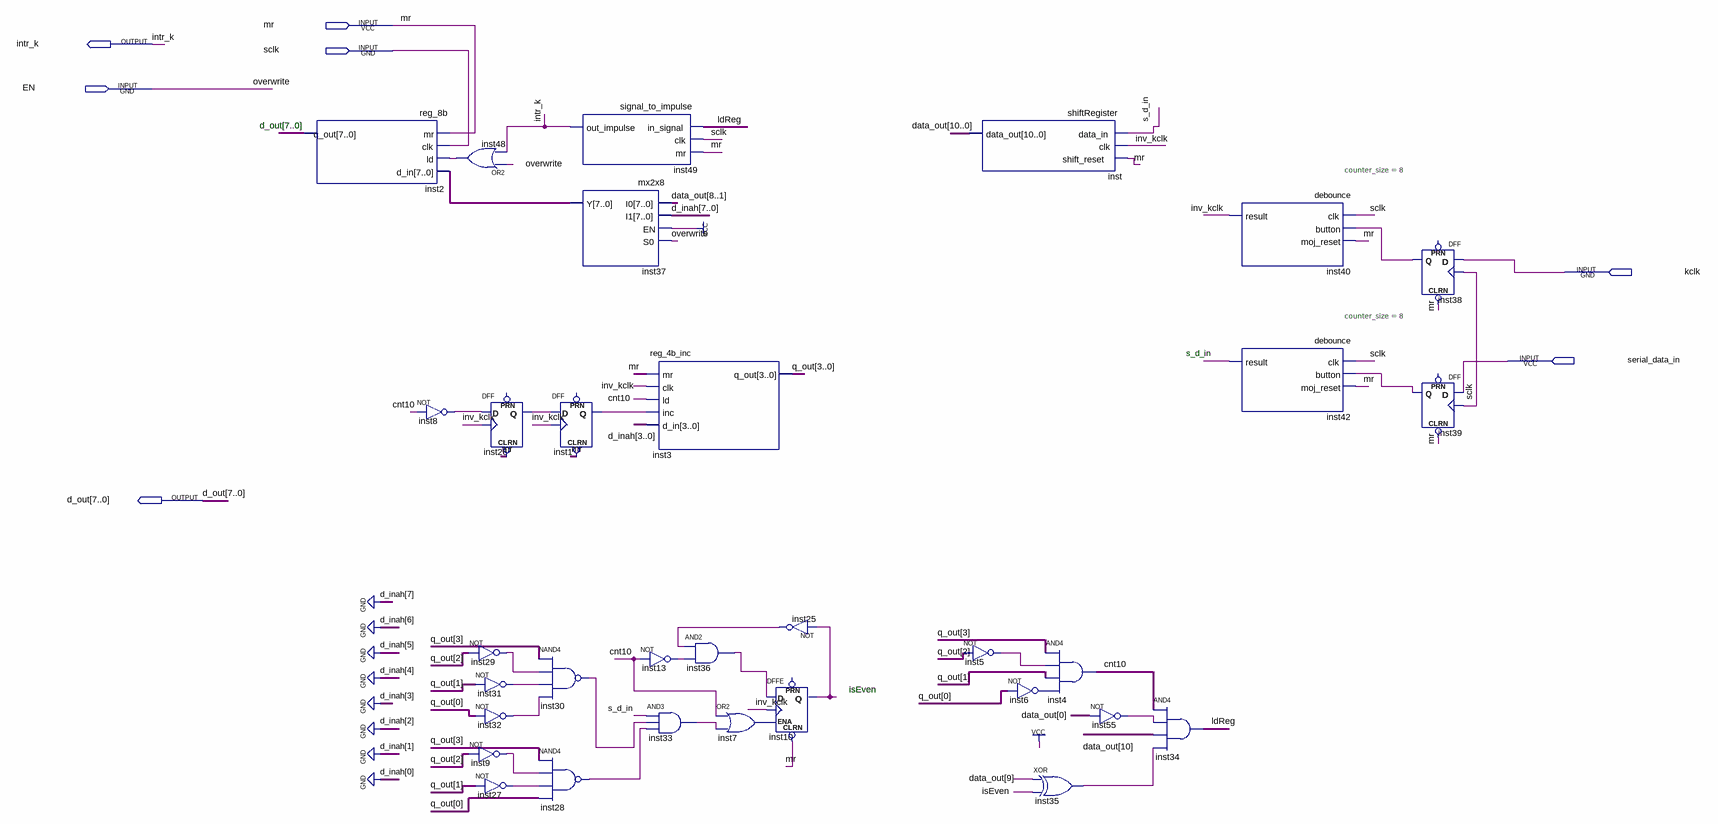
[diagram p0: schematic sheet]
// Quartus schematic ps2controller.bdf as structural Verilog: 32 symbols, 7 pins
module ps2controller (
  input  mr,
  input  sclk,
  input  EN,
  input  kclk,
  input  serial_data_in,
  output intr_k,
  output [7:0] d_out
);

  wire cnt10, inst1_q, inst5_out, inst6_out, inst7_out, inst8_out, inst9_out, inst13_out, inst25_out,
       inst26_q, inst27_out, inst28_out, inst29_out, inst30_out, inst31_out, inst32_out, inst33_out,
       inst35_out, inst36_out, inst38_q, inst39_q, inst48_out, inst55_out, inv_kclk, isEven, ldReg, s_d_in;
  wire [3:0] q_out;
  wire [7:0] inst37_y;
  wire [10:0] data_out;

  reg_8b inst2 (.mr(mr), .clk(sclk), .ld(inst48_out), .d_in(inst37_y), .q_out(d_out));
  not inst8 (inst8_out, cnt10);
  or inst48 (inst48_out, EN, intr_k);
  not inst29 (inst29_out, q_out[2]);
  not inst9 (inst9_out, q_out[2]);
  DFF inst26 (.CLRN(mr), .CLK(inv_kclk), .D(inst8_out), .Q(inst26_q));  // open: PRN
  not inst31 (inst31_out, q_out[1]);
  not inst32 (inst32_out, q_out[0]);
  not inst27 (inst27_out, q_out[1]);
  signal_to_impulse inst49 (.in_signal(ldReg), .clk(sclk), .mr(mr), .out_impulse(intr_k));
  mx2x8 inst37 (.I0(data_out[8:1]), .I1({8{1'b0}}), .EN(1'b1), .S0(EN), .Y(inst37_y));
  DFF inst1 (.CLRN(mr), .CLK(inv_kclk), .D(inst26_q), .Q(inst1_q));  // open: PRN
  nand inst30 (inst30_out, q_out[3], inst29_out, inst31_out, inst32_out);
  nand inst28 (inst28_out, q_out[3], inst9_out, inst27_out, q_out[0]);
  reg_4b_inc inst3 (.mr(mr), .clk(inv_kclk), .ld(cnt10), .inc(inst1_q), .d_in(4'b0000), .q_out(q_out));
  not inst13 (inst13_out, cnt10);
  and inst33 (inst33_out, s_d_in, inst30_out, inst28_out);
  and inst36 (inst36_out, inst25_out, inst13_out);
  or inst7 (inst7_out, cnt10, inst33_out);
  DFFE inst10 (.CLRN(mr), .D(inst36_out), .CLK(inv_kclk), .ENA(inst7_out), .Q(isEven));  // open: PRN
  not inst25 (inst25_out, isEven);
  shiftRegister inst (.data_in(s_d_in), .clk(inv_kclk), .shift_reset(mr), .data_out(data_out));
  not inst5 (inst5_out, q_out[2]);
  not inst6 (inst6_out, q_out[0]);
  and inst4 (cnt10, q_out[3], inst5_out, q_out[1], inst6_out);
  xor inst35 (inst35_out, data_out[9], isEven);
  not inst55 (inst55_out, data_out[0]);
  and inst34 (ldReg, cnt10, inst55_out, data_out[10], inst35_out);
  debounce #(.counter_size(8)) inst40 (.clk(sclk), .button(inst38_q), .moj_reset(mr), .result(inv_kclk));
  debounce #(.counter_size(8)) inst42 (.clk(sclk), .button(inst39_q), .moj_reset(mr), .result(s_d_in));
  DFF inst38 (.CLRN(mr), .CLK(sclk), .D(kclk), .Q(inst38_q));  // open: PRN
  DFF inst39 (.CLRN(mr), .CLK(sclk), .D(serial_data_in), .Q(inst39_q));  // open: PRN

  // Other names for the same wires on the sheet: overwrite = EN

  // Notes on the sheet:
  //   d_out[7..0]
  //   s_d_in
  //   isEven
endmodule
